# Altium schematic sheet arm lpc2148SchDoc.SchDoc
size A4; SheetNumber: 1; SheetTotal: 2
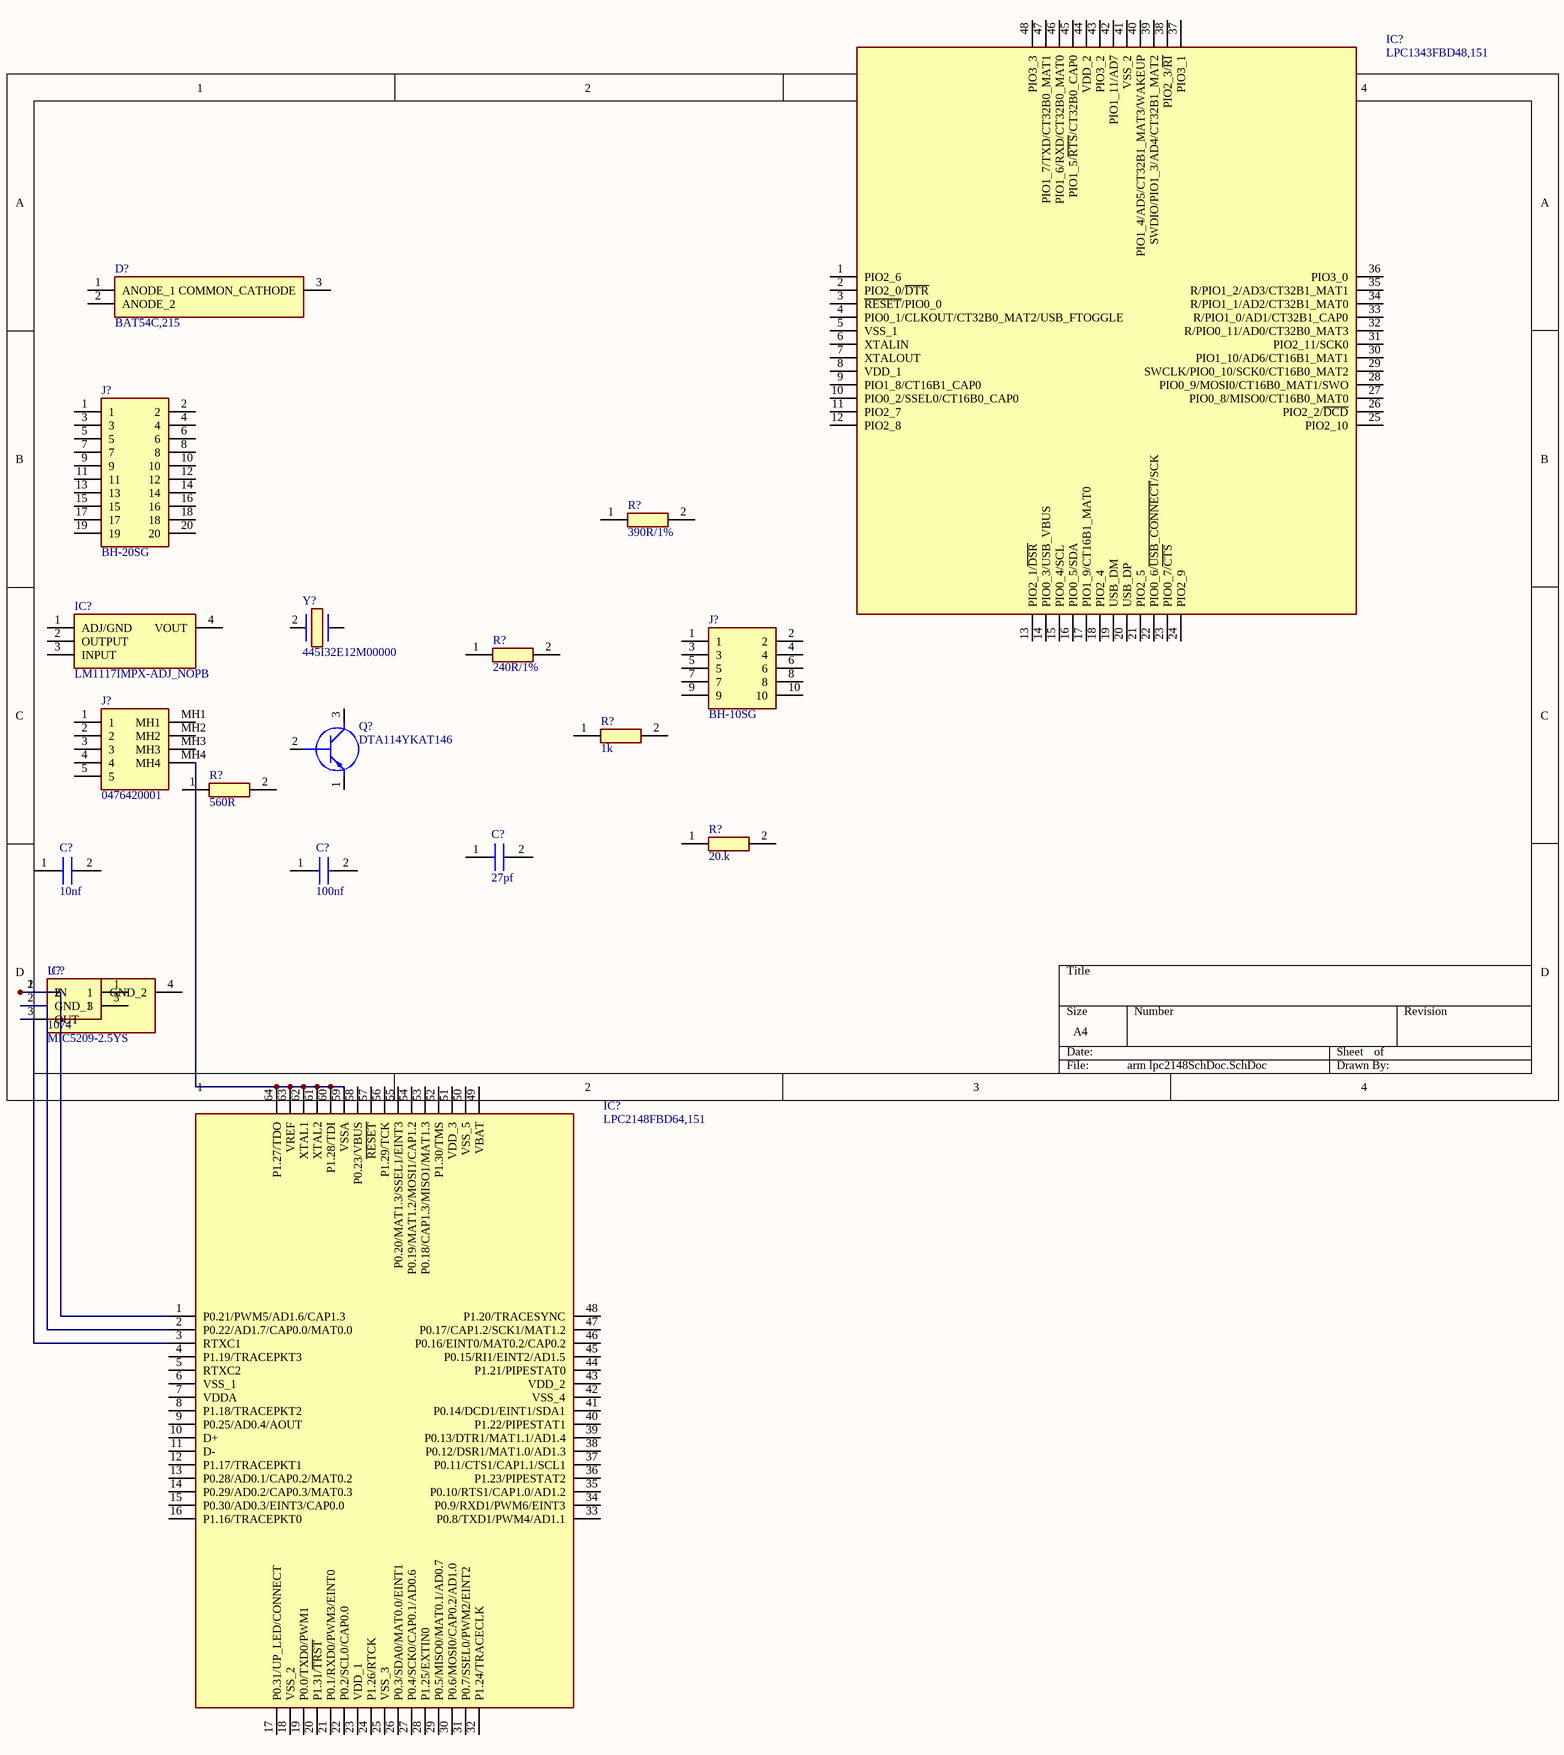
[diagram p0: arm lpc2148SchDoc.SchDoc]

## Parts
(Parts that share a designator on the sheet are numbered #1, #2 ... from top to bottom, then left to right.)
C?#1  27pf  [CAPC0603X33N]
C?#2  10nf  [CAPC1005X56N]
C?#3  100nf  [CAPC1005X56N]
D?  BAT54C,215  [BAT54C215]
IC?#1  LPC1343FBD48,151  [QFP50P900X900X160-48N]
IC?#2  LM1117IMPX-ADJ_NOPB  [SOT230P700X180-4N]
IC?#3  MIC5209-2.5YS  [SOT230P700X180-4N]
IC?#4  LPC2148FBD64,151  [QFP50P1200X1200X160-64N]
J?#1  BH-20SG  [SHDR20W64P254_2X10_3302X910X910P]
J?#2  BH-10SG  [SHDR10W64P254_2X5_2032X910X910P]
J?#3  0476420001  [0476420001]
Q?  DTA114YKAT146  [SOT95P280X140-3N]
R?#1  390R/1%  [RESC1608X50N]
R?#2  240R/1%  [RESC0603X28N]
R?#3  1k  [RESC0603X28N]
R?#4  560R  [RESC1608X55N]
R?#5  20.k  [RESC1005X35N]
U?  1074  [1074]
Y?  445I32E12M00000  [445I32E12M00000]

## Nets
NetIC?#3_1: IC?#3.1(IN) IC?#4.1(P0.21/PWM5/AD1.6/CAP1.3) U?.2
NetIC?#3_2: IC?#3.2(GND_1) IC?#4.2(P0.22/AD1.7/CAP0.0/MAT0.0)
NetIC?#3_3: IC?#3.3(OUT) IC?#4.3(RTXC1)
NetIC?#4_59: IC?#4.59(VSSA) IC?#4.60(P1.28/TDI) IC?#4.61(XTAL2) IC?#4.62(XTAL1) IC?#4.63(VREF) IC?#4.64(P1.27/TDO) J?#3.MH4

Not connected (* = marked no-connect by the designer): C?#1 1 2; C?#2 1 2; C?#3 1 2; D? 1(ANODE_1) 2(ANODE_2) 3(COMMON_CATHODE); IC?#1 1(PIO2_6) 2(PIO2_0/~{DTR}) 3(~{RESET}/PIO0_0) 4(PIO0_1/CLKOUT/CT32B0_MAT2/USB_FTOGGLE) 5(VSS_1) 6(XTALIN) 7(XTALOUT) 8(VDD_1) 9(PIO1_8/CT16B1_CAP0) 10(PIO0_2/SSEL0/CT16B0_CAP0) 11(PIO2_7) 12(PIO2_8) 13(PIO2_1/~{DSR}) 14(PIO0_3/USB_VBUS) 15(PIO0_4/SCL) 16(PIO0_5/SDA) 17(PIO1_9/CT16B1_MAT0) 18(PIO2_4) 19(USB_DM) 20(USB_DP) 21(PIO2_5) 22(PIO0_6/~{USB_CONNECT}/SCK) 23(PIO0_7/~{CTS}) 24(PIO2_9) 25(PIO2_10) 26(PIO2_2/~{DCD}) 27(PIO0_8/MISO0/CT16B0_MAT0) 28(PIO0_9/MOSI0/CT16B0_MAT1/SWO) 29(SWCLK/PIO0_10/SCK0/CT16B0_MAT2) 30(PIO1_10/AD6/CT16B1_MAT1) 31(PIO2_11/SCK0) 32(R/PIO0_11/AD0/CT32B0_MAT3) 33(R/PIO1_0/AD1/CT32B1_CAP0) 34(R/PIO1_1/AD2/CT32B1_MAT0) 35(R/PIO1_2/AD3/CT32B1_MAT1) 36(PIO3_0) 37(PIO3_1) 38(PIO2_3/~{RI}) 39(SWDIO/PIO1_3/AD4/CT32B1_MAT2) 40(PIO1_4/AD5/CT32B1_MAT3/WAKEUP) 41(VSS_2) 42(PIO1_11/AD7) 43(PIO3_2) 44(VDD_2) 45(PIO1_5/~{RTS}/CT32B0_CAP0) 46(PIO1_6/RXD/CT32B0_MAT0) 47(PIO1_7/TXD/CT32B0_MAT1) 48(PIO3_3); IC?#2 1(ADJ/GND) 2(OUTPUT) 3(INPUT) 4(VOUT); IC?#3 4(GND_2); IC?#4 4(P1.19/TRACEPKT3) 5(RTXC2) 6(VSS_1) 7(VDDA) 8(P1.18/TRACEPKT2) 9(P0.25/AD0.4/AOUT) 10(D+) 11(D-) 12(P1.17/TRACEPKT1) 13(P0.28/AD0.1/CAP0.2/MAT0.2) 14(P0.29/AD0.2/CAP0.3/MAT0.3) 15(P0.30/AD0.3/EINT3/CAP0.0) 16(P1.16/TRACEPKT0) 17(P0.31/UP_LED/CONNECT) 18(VSS_2) 19(P0.0/TXD0/PWM1) 20(P1.31/~{TRST}) 21(P0.1/RXD0/PWM3/EINT0) 22(P0.2/SCL0/CAP0.0) 23(VDD_1) 24(P1.26/RTCK) 25(VSS_3) 26(P0.3/SDA0/MAT0.0/EINT1) 27(P0.4/SCK0/CAP0.1/AD0.6) 28(P1.25/EXTIN0) 29(P0.5/MISO0/MAT0.1/AD0.7) 30(P0.6/MOSI0/CAP0.2/AD1.0) 31(P0.7/SSEL0/PWM2/EINT2) 32(P1.24/TRACECLK) 33(P0.8/TXD1/PWM4/AD1.1) 34(P0.9/RXD1/PWM6/EINT3) 35(P0.10/RTS1/CAP1.0/AD1.2) 36(P1.23/PIPESTAT2) 37(P0.11/CTS1/CAP1.1/SCL1) 38(P0.12/DSR1/MAT1.0/AD1.3) 39(P0.13/DTR1/MAT1.1/AD1.4) 40(P1.22/PIPESTAT1) 41(P0.14/DCD1/EINT1/SDA1) 42(VSS_4) 43(VDD_2) 44(P1.21/PIPESTAT0) 45(P0.15/RI1/EINT2/AD1.5) 46(P0.16/EINT0/MAT0.2/CAP0.2) 47(P0.17/CAP1.2/SCK1/MAT1.2) 48(P1.20/TRACESYNC) 49(VBAT) 50(VSS_5) 51(VDD_3) 52(P1.30/TMS) 53(P0.18/CAP1.3/MISO1/MAT1.3) 54(P0.19/MAT1.2/MOSI1/CAP1.2) 55(P0.20/MAT1.3/SSEL1/EINT3) 56(P1.29/TCK) 57(~{RESET}) 58(P0.23/VBUS); J?#1 1 2 3 4 5 6 7 8 9 10 11 12 13 14 15 16 17 18 19 20; J?#2 1 2 3 4 5 6 7 8 9 10; J?#3 1 2 3 4 5 MH1 MH2 MH3; Q? 1(E) 2(B) 3(C); R?#1 1 2; R?#2 1 2; R?#3 1 2; R?#4 1 2; R?#5 1 2; U? 1 3; Y? 2(CRYSTAL_2) ?1

## Library data of the parts
C?#1 = 02013A270GAT2A: Capacitor; Manufacturer_Name: Kyocera AVX; Datasheet Link: http://www.mouser.com/catalog/supplier/library/pdf/AVXSurfaceMountCeramic.pdf; Height: 0.33mm; Manufacturer_Part_Number: 02013A270GAT2A; Mouser Part Number: 581-02013A270GAT2A; Mouser Price/Stock: https://www.mouser.com/Search/Refine.aspx?Keyword=581-02013A270GAT2A
C?#2 = 04023C103JAT2A: Capacitor; Manufacturer_Name: Kyocera AVX; Datasheet Link: http://www.mouser.com/catalog/supplier/library/pdf/AVXSurfaceMountCeramic.pdf; Height: 0.56mm; Manufacturer_Part_Number: 04023C103JAT2A; Mouser Part Number: 581-04023C103JAT2A; Mouser Price/Stock: https://www.mouser.co.uk/ProductDetail/AVX/04023C103JAT2A/?qs=BZUx2bqs%2FdVR7R6u7tNJeg%3D%3D; Arrow Part Number: 04023C103JAT2A; Arrow Price/Stock: https://www.arrow.com/en/products/04023c103jat2a/avx
C?#3 = 04026D104KAT2A: Capacitor; Manufacturer_Name: Kyocera AVX; Datasheet Link: http://www.mouser.com/catalog/supplier/library/pdf/AVXSurfaceMountCeramic.pdf; Height: 0.56mm; Manufacturer_Part_Number: 04026D104KAT2A; Mouser Part Number: 581-04026D104KAT2A; Mouser Price/Stock: https://www.mouser.co.uk/ProductDetail/AVX/04026D104KAT2A?qs=LLG2yGGJ5NhILwMziGI8Xg%3D%3D; Arrow Part Number: 04026D104KAT2A; Arrow Price/Stock: https://www.arrow.com/en/products/04026d104kat2a/avx?region=nac
D? = BAT54C,215: Schottky Diode; Manufacturer_Name: Nexperia; Datasheet Link: https://assets.nexperia.com/documents/data-sheet/BAT54_SER.pdf; Height: 1.1mm; Manufacturer_Part_Number: BAT54C,215; Mouser Part Number: 771-BAT54C-T/R; Mouser Price/Stock: https://www.mouser.co.uk/ProductDetail/Nexperia/BAT54C215?qs=me8TqzrmIYV5SKKt13YKQA%3D%3D; Arrow Part Number: BAT54C,215; Arrow Price/Stock: https://www.arrow.com/en/products/bat54c215/nexperia?region=europe
IC?#1 = LPC1343FBD48,151: Integrated Circuit; Manufacturer_Name: NXP; Datasheet Link: http://www.nxp.com/docs/en/data-sheet/LPC1311_13_42_43.pdf; Height: 1.6mm; Manufacturer_Part_Number: LPC1343FBD48,151; Mouser Part Number: 771-LPC1343FBD48151; Mouser Price/Stock: https://www.mouser.co.uk/ProductDetail/NXP-Semiconductors/LPC1343FBD48151/?qs=GXxaSVPoQQrV0FOIhs3F%252BQ%3D%3D; Arrow Part Number: LPC1343FBD48,151; Arrow Price/Stock: https://www.arrow.com/en/products/lpc1343fbd48151/nxp-semiconductors
IC?#2 = LM1117IMPX-ADJ_NOPB: Integrated Circuit; Manufacturer_Name: Texas Instruments; Manufacturer_Part_Number: LM1117IMPX-ADJ/NOPB; Datasheet Link: http://www.ti.com/general/docs/suppproductinfo.tsp?distId=10&gotoUrl=http%3A%2F%2Fwww.ti.com%2Flit%2Fgpn%2Flm1117; Height: 1.8mm; Mouser Part Number: 926-M1117IMPXADJNOPB; Mouser Price/Stock: https://www.mouser.co.uk/ProductDetail/Texas-Instruments/LM1117IMPX-ADJ-NOPB?qs=X1J7HmVL2ZH7x9eSBiUHaQ%3D%3D; Arrow Part Number: LM1117IMPX-ADJ/NOPB; Arrow Price/Stock: https://www.arrow.com/en/products/lm1117impx-adjnopb/texas-instruments?region=europe
IC?#3 = MIC5209-2.5YS: Integrated Circuit; Manufacturer_Name: Microchip; Datasheet Link: https://componentsearchengine.com/Datasheets/2/MIC5209-2.5YS.pdf; Height: 1.8mm; Manufacturer_Part_Number: MIC5209-2.5YS; Mouser Part Number: 998-MIC5209-2.5YS; Mouser Price/Stock: https://www.mouser.co.uk/ProductDetail/Microchip-Technology/MIC5209-2.5YS?qs=kh6iOki%2FeLGfmmYc%252Bdo3Yw%3D%3D; Arrow Part Number: MIC5209-2.5YS; Arrow Price/Stock: https://www.arrow.com/en/products/mic5209-2.5ys/microchip-technology?region=nac
IC?#4 = LPC2148FBD64,151: Integrated Circuit; Manufacturer_Name: NXP; Datasheet Link: http://www.nxp.com/docs/en/data-sheet/LPC2141_42_44_46_48.pdf; Height: 1.6mm; Manufacturer_Part_Number: LPC2148FBD64,151; Mouser Part Number: 771-LPC2148FBD64-S; Mouser Price/Stock: https://www.mouser.co.uk/ProductDetail/NXP-Semiconductors/LPC2148FBD64151?qs=LOCUfHb8d9tLYNKsr9f%252BRg%3D%3D; Arrow Part Number: LPC2148FBD64,151; Arrow Price/Stock: https://www.arrow.com/en/products/lpc2148fbd64151/nxp-semiconductors
J?#1 = BH-20SG: Connector; Manufacturer_Name: Useconn Electronics; Datasheet Link: http://akizukidenshi.com/download/ds/useconn/BH-XXSG.pdf; Height: 9.1mm; Manufacturer_Part_Number: BH-20SG
J?#2 = BH-10SG: Connector; Manufacturer_Name: Useconn Electronics; Datasheet Link: http://akizukidenshi.com/download/ds/useconn/BH-XXSG.pdf; Height: 9.1mm; Manufacturer_Part_Number: BH-10SG
J?#3 = 0476420001: Connector; Manufacturer_Name: Molex; Datasheet Link: https://www.molex.com/pdm_docs/sd/476420001_sd.pdf; Height: 2.94mm; Manufacturer_Part_Number: 0476420001; Mouser Part Number: N/A; Mouser Price/Stock: https://www.mouser.co.uk/ProductDetail/Molex/0476420001?qs=PBcRNPEHKsrxICNNodjW6Q%3D%3D; Arrow Part Number: 0476420001; Arrow Price/Stock: https://www.arrow.com/en/products/0476420001/molex?region=nac
Q? = DTA114YKAT146: Transistor BJT PNP; Manufacturer_Name: ROHM Semiconductor; Datasheet Link: https://fscdn.rohm.com/en/products/databook/datasheet/discrete/transistor/digital/dta114ye3-e.pdf; Height: 1.4mm; Manufacturer_Part_Number: DTA114YKAT146; Mouser Part Number: 755-DTA114YKAT146; Mouser Price/Stock: https://www.mouser.co.uk/ProductDetail/ROHM-Semiconductor/DTA114YKAT146?qs=4kLU8WoGk0vXacJ3xWrubQ%3D%3D
R?#1 = CRCW0603390RFKEB: Resistor; Manufacturer_Name: Vishay; Datasheet Link: http://www.vishay.com/docs/20035/dcrcwe3.pdf; Height: 0.5mm; Manufacturer_Part_Number: CRCW0603390RFKEB; Mouser Part Number: 71-CRCW0603390RFKEB; Mouser Price/Stock: https://www.mouser.co.uk/ProductDetail/Vishay-Dale/CRCW0603390RFKEB?qs=xDiHhyYQ5otRAwyfXn0Rhw%3D%3D
R?#2 = CRCW0201240RFKED: Resistor; Manufacturer_Name: Vishay; Datasheet Link: http://www.vishay.com/docs/20035/dcrcwe3.pdf; Height: 0.28mm; Manufacturer_Part_Number: CRCW0201240RFKED; Mouser Part Number: 71-CRCW0201240RFKED; Mouser Price/Stock: https://www.mouser.co.uk/ProductDetail/Vishay-Dale/CRCW0201240RFKED?qs=3bSaU8eFeoGYW3mA1C8JOg%3D%3D; Arrow Part Number: CRCW0201240RFKED; Arrow Price/Stock: https://www.arrow.com/en/products/crcw0201240rfked/vishay
R?#3 = CPF0201D523RE1: Resistor; Manufacturer_Name: TE Connectivity; Datasheet Link: http://www.te.com/commerce/DocumentDelivery/DDEController?Action=showdoc&DocId=Data+Sheet%7F1773200-1%7FA%7Fpdf%7FEnglish%7FENG_DS_1773200-1_A.pdf%7F4-2176215-6; Height: 0.28mm; Manufacturer_Part_Number: CPF0201D523RE1; Mouser Part Number: N/A; Mouser Price/Stock: https://www.mouser.co.uk/ProductDetail/TE-Connectivity-Neohm/CPF0201D523RE1?qs=chTDxNqvsymvQooxiPoh2A%3D%3D
R?#4 = CR0603-FX-5600ELF: Resistor; Manufacturer_Name: Bourns; Datasheet Link: https://www.bourns.com/pdfs/chpreztr.pdf; Height: 0.55mm; Manufacturer_Part_Number: CR0603-FX-5600ELF; Mouser Part Number: 652-CR0603FX-5600ELF; Mouser Price/Stock: https://www.mouser.co.uk/ProductDetail/Bourns/CR0603-FX-5600ELF?qs=0nF2VnfAjXldqEoVxdic1Q%3D%3D; Arrow Part Number: CR0603-FX-5600ELF; Arrow Price/Stock: https://www.arrow.com/en/products/cr0603-fx-5600elf/bourns
R?#5 = CPF0402B1K2E: Resistor; Manufacturer_Name: TE Connectivity; Datasheet Link: http://www.farnell.com/datasheets/1786775.pdf; Height: 0.35mm; Manufacturer_Part_Number: CPF0402B1K2E
U? = 1074: Undefined or Miscellaneous; Manufacturer_Name: Keystone Electronics; Datasheet Link: https://www.keyelco.com/product-pdf.cfm?p=14390; Height: 18.3mm; Manufacturer_Part_Number: 1074; Mouser Part Number: 534-1074; Mouser Price/Stock: https://www.mouser.co.uk/ProductDetail/Keystone-Electronics/1074?qs=u16ybLDytRZ%2FZj7HSRmD5g%3D%3D
Y? = 445I32E12M00000: Crystal or Oscillator; Manufacturer_Name: CTS; Datasheet Link: https://www.mouser.com/datasheet/2/96/008-0360-0-786290.pdf; Height: 1.35mm; Manufacturer_Part_Number: 445I32E12M00000